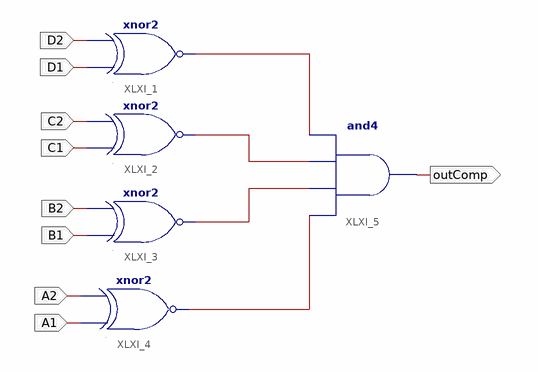
[diagram p0: schematic sheet 1]
// Xilinx ISE schematic compare.sch (spartan6) as structural Verilog: 5 symbols, 9 ports
module compare (
  input  D2,
  input  D1,
  input  C2,
  input  C1,
  input  B2,
  input  B1,
  input  A2,
  input  A1,
  output outComp
);

  wire XLXN_1, XLXN_2, XLXN_3, XLXN_4;

  xnor XLXI_1 (XLXN_1, D1, D2);
  xnor XLXI_2 (XLXN_2, C1, C2);
  xnor XLXI_3 (XLXN_3, B1, B2);
  xnor XLXI_4 (XLXN_4, A1, A2);
  and XLXI_5 (outComp, XLXN_4, XLXN_3, XLXN_2, XLXN_1);
endmodule
